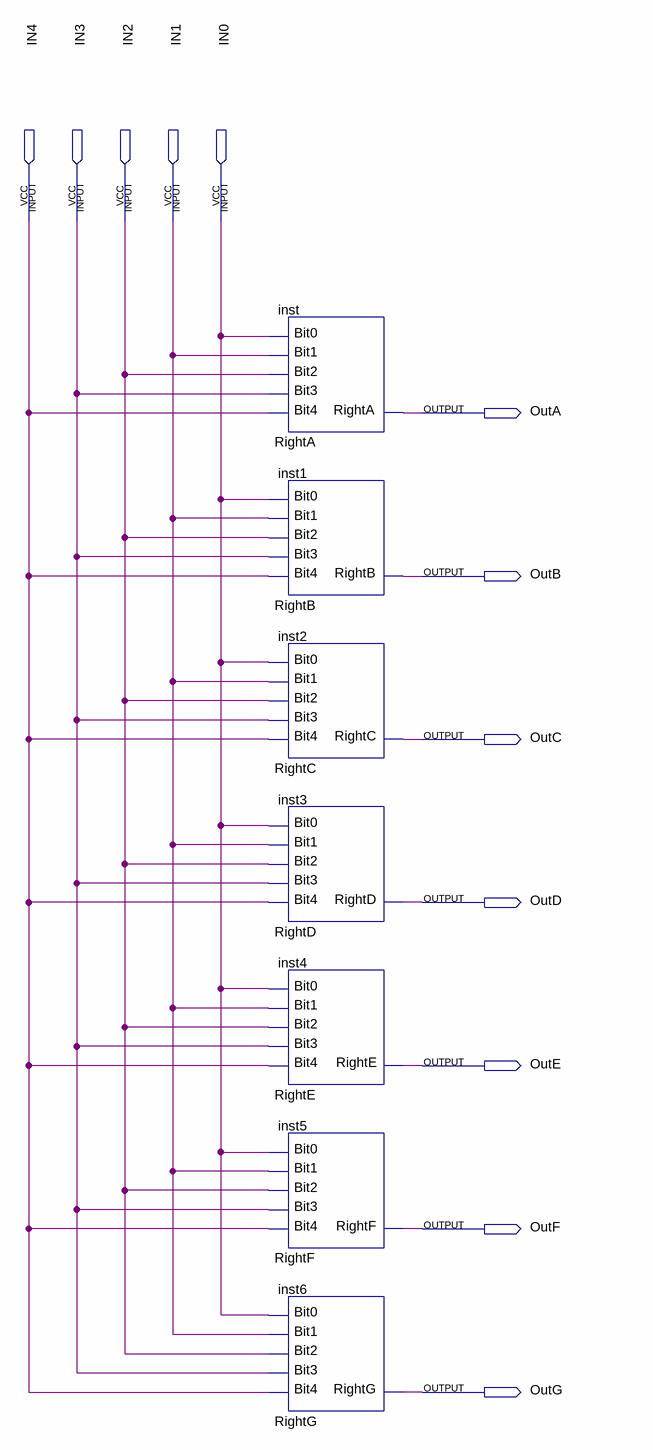
[diagram p0: schematic sheet]
// Quartus schematic R-DECOD.bdf as structural Verilog: 7 symbols, 12 pins
module \R-DECOD  (
  input  IN4,
  input  IN3,
  input  IN2,
  input  IN1,
  input  IN0,
  output OutA,
  output OutB,
  output OutC,
  output OutD,
  output OutE,
  output OutF,
  output OutG
);

  RightA inst (.Bit4(IN4), .Bit3(IN3), .Bit2(IN2), .Bit1(IN1), .Bit0(IN0), .RightA(OutA));
  RightB inst1 (.Bit4(IN4), .Bit3(IN3), .Bit2(IN2), .Bit1(IN1), .Bit0(IN0), .RightB(OutB));
  RightC inst2 (.Bit4(IN4), .Bit3(IN3), .Bit2(IN2), .Bit1(IN1), .Bit0(IN0), .RightC(OutC));
  RightD inst3 (.Bit4(IN4), .Bit3(IN3), .Bit2(IN2), .Bit1(IN1), .Bit0(IN0), .RightD(OutD));
  RightE inst4 (.Bit4(IN4), .Bit3(IN3), .Bit2(IN2), .Bit1(IN1), .Bit0(IN0), .RightE(OutE));
  RightF inst5 (.Bit4(IN4), .Bit3(IN3), .Bit2(IN2), .Bit1(IN1), .Bit0(IN0), .RightF(OutF));
  RightG inst6 (.Bit4(IN4), .Bit3(IN3), .Bit2(IN2), .Bit1(IN1), .Bit0(IN0), .RightG(OutG));
endmodule
